# EasyEDA Pro project 40_keyboard.epro, schematic 40键盘

## Sheets
1 键盘矩阵
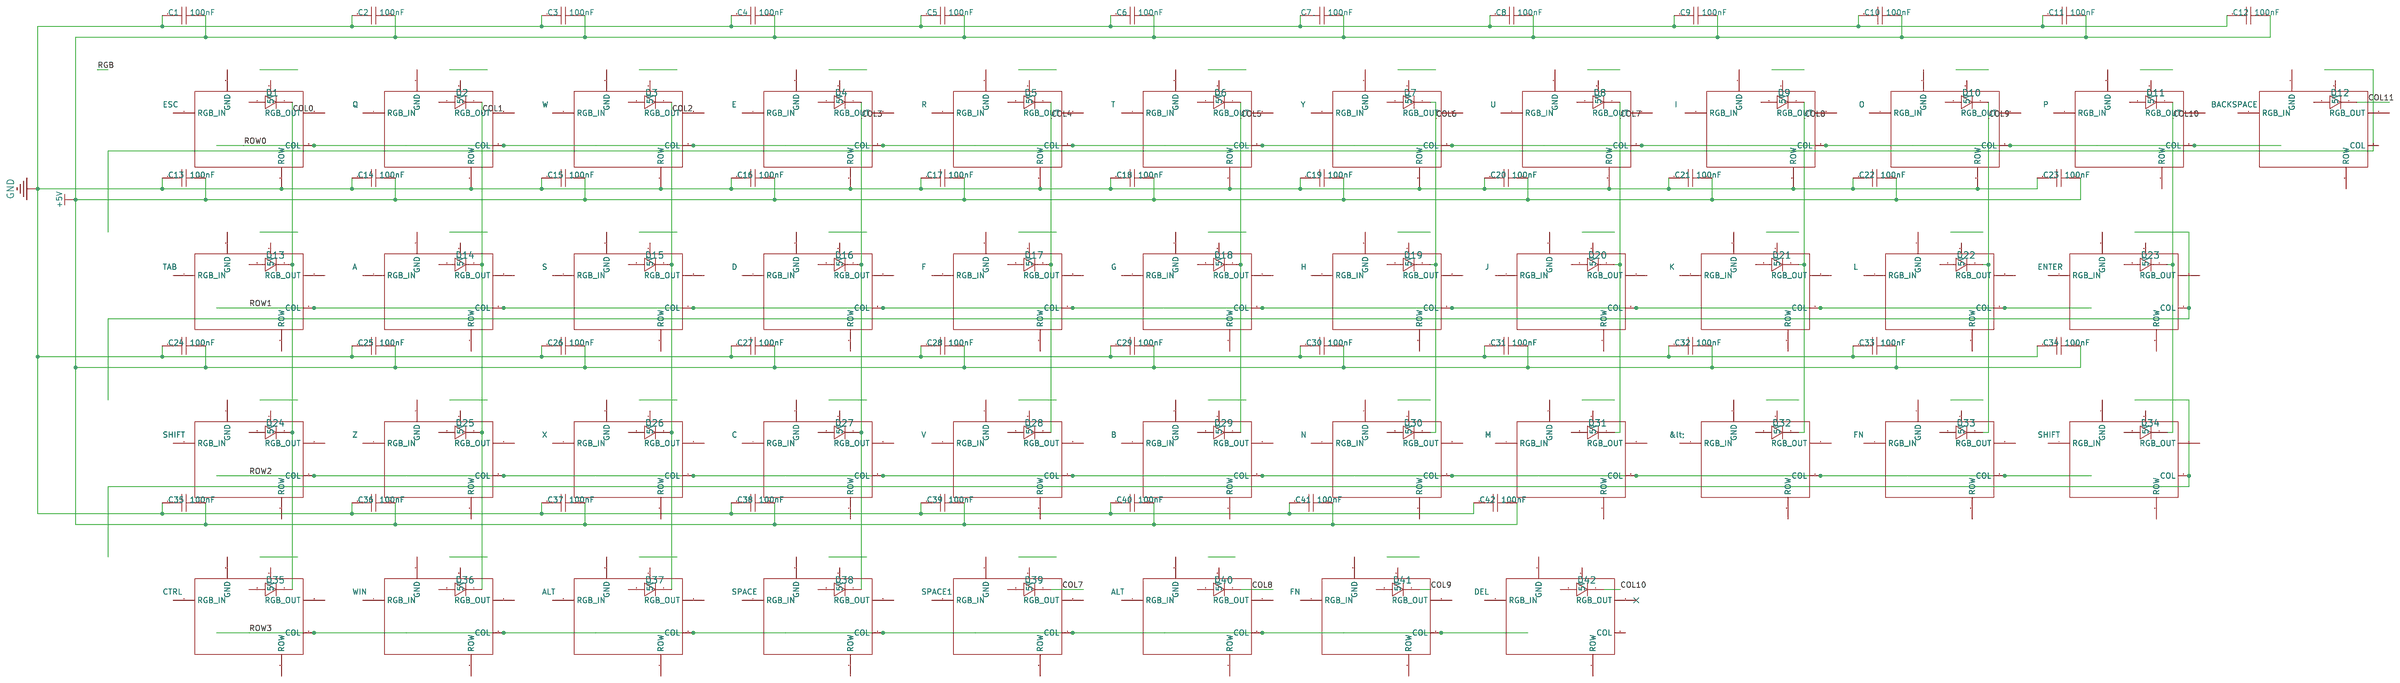
[diagram p0: 键盘矩阵]
2 主控相关: Create Date: 2023-02-02; Page Name: 主控相关; Project Name: 键盘; Schematic Name: 40键盘; Update Date: 2023-02-02; Company: 嘉立创EDA; Page Size: A5; Version: V1.0
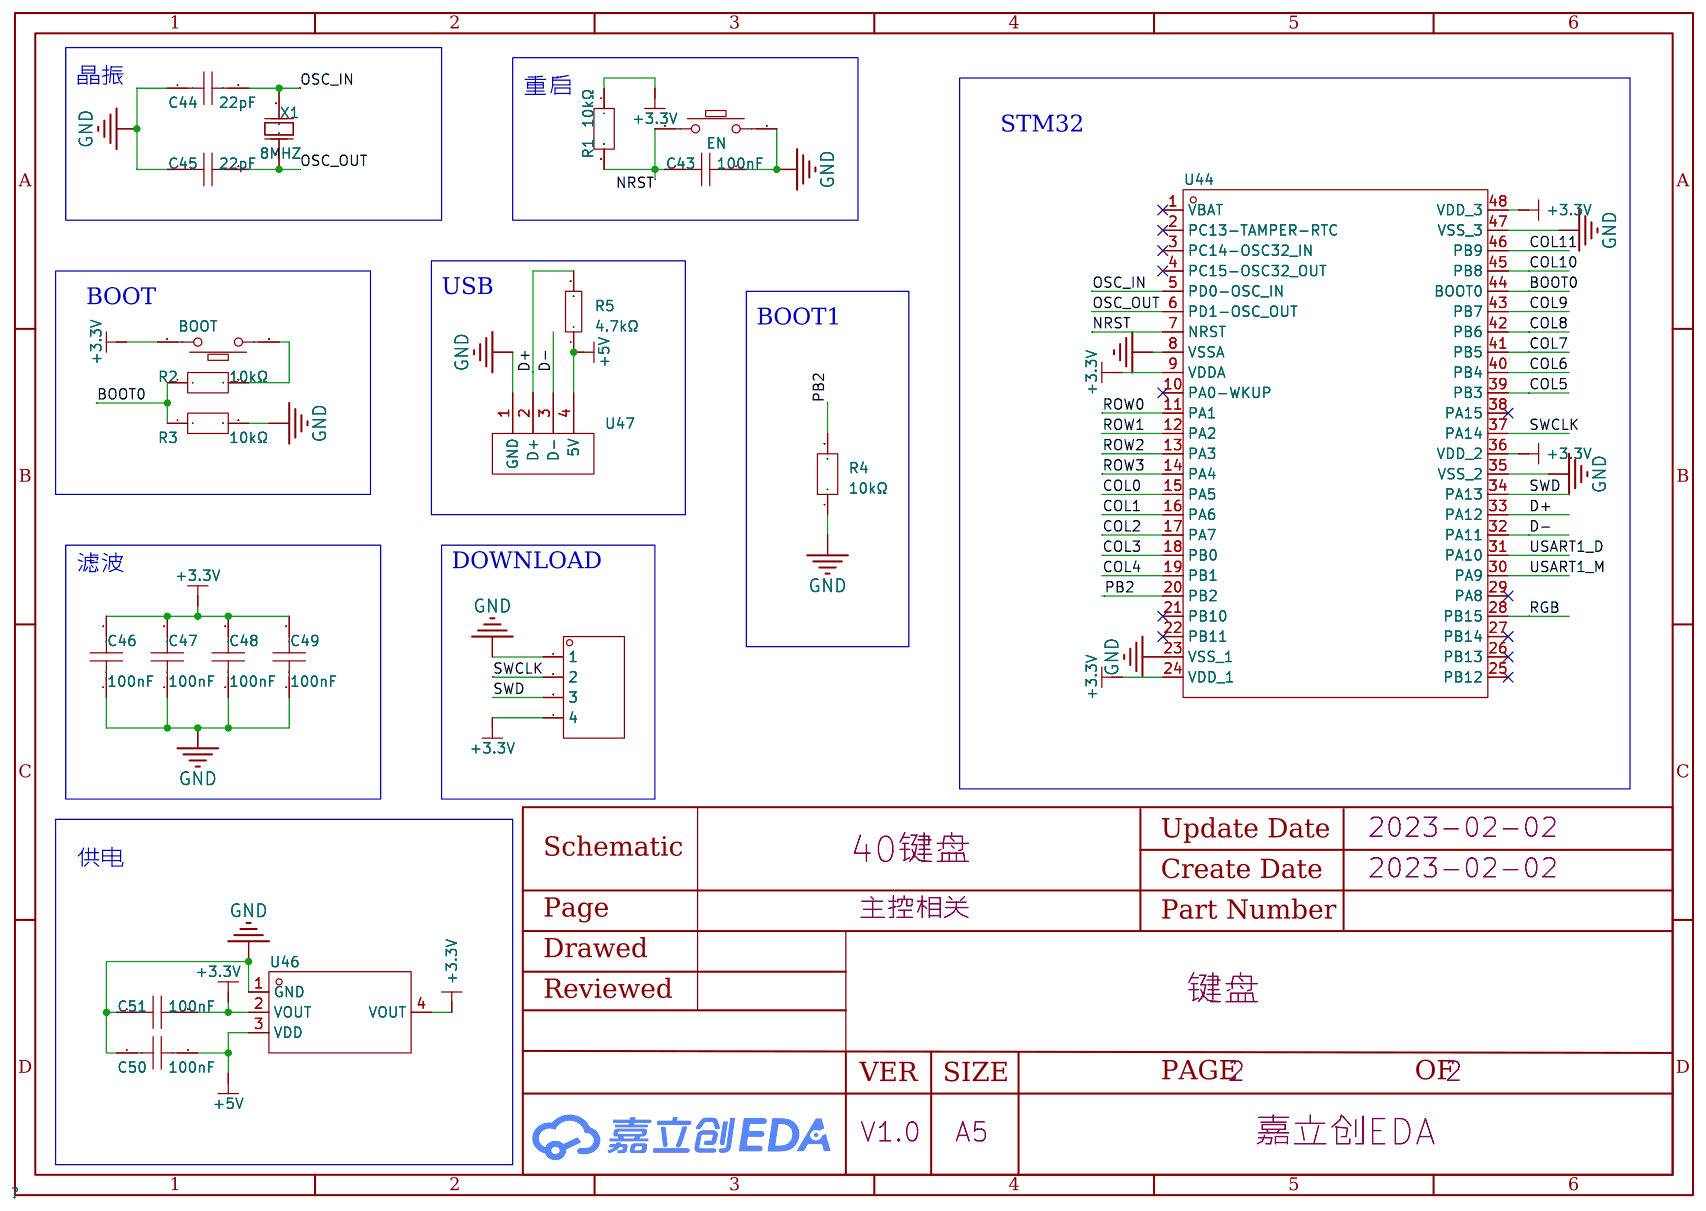
[diagram p1: 主控相关]

## Parts
sheet 主控相关
BOOT  -  [SW-SMD_L6.0-W3.7-LS8.0]
C43  100nF  [C0603]
C44  22pF  [C0603]
C45  22pF  [C0603]
C46  100nF  [C0603]
C47  100nF  [C0603]
C48  100nF  [C0603]
C49  100nF  [C0603]
C50  100nF  [C0603]
C51  100nF  [C0603]
EN  -  [SW-SMD_L6.0-W3.7-LS8.0]
H1  -  [HDR-TH_4P-P2.54-V-M]
R1  10kΩ  [R0603]
R2  10kΩ  [R0603]
R3  10kΩ  [R0603]
R4  10kΩ  [R0603]
R5  4.7kΩ  [R0603]
U44  -  [LQFP-48_L7.0-W7.0-P0.50-LS9.0-BL]
U46  -  [SOT-223_L6.5-W3.5-P2.30-LS7.0-BR]
U47  -  [TYPEC]
X1  8MHZ  [CRYSTAL-SMD_2P-L5.0-W3.2]
sheet 键盘矩阵
C1  100nF  [C0603]
C2  100nF  [C0603]
C3  100nF  [C0603]
C4  100nF  [C0603]
C5  100nF  [C0603]
C6  100nF  [C0603]
C7  100nF  [C0603]
C8  100nF  [C0603]
C9  100nF  [C0603]
C10  100nF  [C0603]
C11  100nF  [C0603]
C12  100nF  [C0603]
C13  100nF  [C0603]
C14  100nF  [C0603]
C15  100nF  [C0603]
C16  100nF  [C0603]
C17  100nF  [C0603]
C18  100nF  [C0603]
C19  100nF  [C0603]
C20  100nF  [C0603]
C21  100nF  [C0603]
C22  100nF  [C0603]
C23  100nF  [C0603]
C24  100nF  [C0603]
C25  100nF  [C0603]
C26  100nF  [C0603]
C27  100nF  [C0603]
C28  100nF  [C0603]
C29  100nF  [C0603]
C30  100nF  [C0603]
C31  100nF  [C0603]
C32  100nF  [C0603]
C33  100nF  [C0603]
C34  100nF  [C0603]
C35  100nF  [C0603]
C36  100nF  [C0603]
C37  100nF  [C0603]
C38  100nF  [C0603]
C39  100nF  [C0603]
C40  100nF  [C0603]
C41  100nF  [C0603]
C42  100nF  [C0603]
D1  IN4148WS  [SOD-323_L1.8-W1.3-LS2.5-RD]
D2  IN4148WS  [SOD-323_L1.8-W1.3-LS2.5-RD]
D3  IN4148WS  [SOD-323_L1.8-W1.3-LS2.5-RD]
D4  IN4148WS  [SOD-323_L1.8-W1.3-LS2.5-RD]
D5  IN4148WS  [SOD-323_L1.8-W1.3-LS2.5-RD]
D6  IN4148WS  [SOD-323_L1.8-W1.3-LS2.5-RD]
D7  IN4148WS  [SOD-323_L1.8-W1.3-LS2.5-RD]
D8  IN4148WS  [SOD-323_L1.8-W1.3-LS2.5-RD]
D9  IN4148WS  [SOD-323_L1.8-W1.3-LS2.5-RD]
D10  IN4148WS  [SOD-323_L1.8-W1.3-LS2.5-RD]
D11  IN4148WS  [SOD-323_L1.8-W1.3-LS2.5-RD]
D12  IN4148WS  [SOD-323_L1.8-W1.3-LS2.5-RD]
D13  IN4148WS  [SOD-323_L1.8-W1.3-LS2.5-RD]
D14  IN4148WS  [SOD-323_L1.8-W1.3-LS2.5-RD]
D15  IN4148WS  [SOD-323_L1.8-W1.3-LS2.5-RD]
D16  IN4148WS  [SOD-323_L1.8-W1.3-LS2.5-RD]
D17  IN4148WS  [SOD-323_L1.8-W1.3-LS2.5-RD]
D18  IN4148WS  [SOD-323_L1.8-W1.3-LS2.5-RD]
D19  IN4148WS  [SOD-323_L1.8-W1.3-LS2.5-RD]
D20  IN4148WS  [SOD-323_L1.8-W1.3-LS2.5-RD]
D21  IN4148WS  [SOD-323_L1.8-W1.3-LS2.5-RD]
D22  IN4148WS  [SOD-323_L1.8-W1.3-LS2.5-RD]
D23  IN4148WS  [SOD-323_L1.8-W1.3-LS2.5-RD]
D24  IN4148WS  [SOD-323_L1.8-W1.3-LS2.5-RD]
D25  IN4148WS  [SOD-323_L1.8-W1.3-LS2.5-RD]
D26  IN4148WS  [SOD-323_L1.8-W1.3-LS2.5-RD]
D27  IN4148WS  [SOD-323_L1.8-W1.3-LS2.5-RD]
D28  IN4148WS  [SOD-323_L1.8-W1.3-LS2.5-RD]
D29  IN4148WS  [SOD-323_L1.8-W1.3-LS2.5-RD]
D30  IN4148WS  [SOD-323_L1.8-W1.3-LS2.5-RD]
D31  IN4148WS  [SOD-323_L1.8-W1.3-LS2.5-RD]
D32  IN4148WS  [SOD-323_L1.8-W1.3-LS2.5-RD]
D33  IN4148WS  [SOD-323_L1.8-W1.3-LS2.5-RD]
D34  IN4148WS  [SOD-323_L1.8-W1.3-LS2.5-RD]
D35  IN4148WS  [SOD-323_L1.8-W1.3-LS2.5-RD]
D36  IN4148WS  [SOD-323_L1.8-W1.3-LS2.5-RD]
D37  IN4148WS  [SOD-323_L1.8-W1.3-LS2.5-RD]
D38  IN4148WS  [SOD-323_L1.8-W1.3-LS2.5-RD]
D39  IN4148WS  [SOD-323_L1.8-W1.3-LS2.5-RD]
D40  IN4148WS  [SOD-323_L1.8-W1.3-LS2.5-RD]
D41  IN4148WS  [SOD-323_L1.8-W1.3-LS2.5-RD]
D42  IN4148WS  [SOD-323_L1.8-W1.3-LS2.5-RD]
U1  ESC  [反贴rgb仅焊接轴]
U2  Q  [反贴rgb仅焊接轴]
U3  W  [反贴rgb仅焊接轴]
U4  E  [反贴rgb仅焊接轴]
U5  R  [反贴rgb仅焊接轴]
U6  T  [反贴rgb仅焊接轴]
U7  Y  [反贴rgb仅焊接轴]
U8  U  [反贴rgb仅焊接轴]
U9  I  [反贴rgb仅焊接轴]
U10  O  [反贴rgb仅焊接轴]
U11  P  [反贴rgb仅焊接轴]
U12  BACKSPACE  [反贴rgb仅焊接轴]
U13  TAB  [反贴rgb仅焊接轴]
U14  A  [反贴rgb仅焊接轴]
U15  S  [反贴rgb仅焊接轴]
U16  D  [反贴rgb仅焊接轴]
U17  F  [反贴rgb仅焊接轴]
U18  G  [反贴rgb仅焊接轴]
U19  H  [反贴rgb仅焊接轴]
U20  J  [反贴rgb仅焊接轴]
U21  K  [反贴rgb仅焊接轴]
U22  L  [反贴rgb仅焊接轴]
U23  ENTER  [反贴rgb仅焊接轴]
U24  SHIFT  [反贴rgb仅焊接轴]
U25  Z  [反贴rgb仅焊接轴]
U26  X  [反贴rgb仅焊接轴]
U27  C  [反贴rgb仅焊接轴]
U28  V  [反贴rgb仅焊接轴]
U29  B  [反贴rgb仅焊接轴]
U30  N  [反贴rgb仅焊接轴]
U31  M  [反贴rgb仅焊接轴]
U32  &lt;  [反贴rgb仅焊接轴]
U33  FN  [反贴rgb仅焊接轴]
U34  SHIFT  [反贴rgb仅焊接轴]
U35  CTRL  [反贴rgb仅焊接轴]
U36  WIN  [反贴rgb仅焊接轴]
U37  ALT  [反贴rgb仅焊接轴]
U38  SPACE  [反贴rgb仅焊接轴]
U39  SPACE1  [反贴rgb仅焊接轴]
U40  ALT  [反贴rgb仅焊接轴]
U41  FN  [反贴rgb仅焊接轴]
U42  DEL  [反贴rgb仅焊接轴]

## Library data of the parts
BOOT EN = TS-1107-025E-W: 轻触开关/TS-1107-025E; LCSC Part Name: 轻触开关/TS-1107-025E; Supplier Part: C2939214; Manufacturer: HOOYA(香港皓宇); Supplier Footprint: SMD; Datasheet: https://atta.szlcsc.com/upload/public/pdf/source/20220629/BFBE6602B3F172776706CD86E3EAF173.pdf; Supplier: LCSC
C1-C43 C46-C51 = CC0603KRX7R9BB104: 容值:100nF;精度:±10%;额定电压:50V;温度系数:X7R;; LCSC Part Name: 100nF ±10% 50V; Supplier Part: C14663; Manufacturer: YAGEO(国巨); Supplier Footprint: 0603; JLCPCB Part Class: Basic Part; Datasheet: https://atta.szlcsc.com/upload/public/pdf/source/20170116/1484561234239.pdf; Supplier: LCSC; Tolerance: ±10%; Voltage Rated: 50V; Temperature Coefficient: X7R
C44 C45 = C0603C220K4GAC7867: 容值:22pF;精度:±10%;额定电压:16V;温度系数:C0G;; LCSC Part Name: 22pF ±10% 16V; Supplier Part: C599693; Manufacturer: KEMET(基美); Supplier Footprint: 0603; JLCPCB Part Class: Extended Part; Datasheet: https://atta.szlcsc.com/upload/public/pdf/source/20200618/C599693_6DA331CD029F9269394E639C222571D4.pdf; Supplier: LCSC; Tolerance: ±10%; Voltage Rated: 16V; Temperature Coefficient: C0G
H1 = B-2100S04P-A110: 间距:2.54mm;总PIN位数:4;排数:1;插针结构:1x4P;行距:-;安装类型:直插;圆针/方针:-;额定电流:-;额定电压:-;配合针长度:6mm;塑高:2.54mm;端接针长度:3mm;触头材质:黄铜;触头镀层:-;工作温度范围:-40~+105;颜色:黑色;; Supplier: LCSC; Supplier Part: C124378; Supplier Footprint: 插件,P=2.54mm; JLCPCB Part Class: Extended Part; LCSC Part Name: 2.54mm 1x4P; Datasheet: https://atta.szlcsc.com/upload/public/pdf/source/20170821/C124378_1503303307508901532.pdf; Color: 黑色; Manufacturer: Ckmtw(灿科盟); Contact Material: 黄铜; Insulation Height: 2.54mm; Length of End Connection Pin: 3mm; Length of Mating Pin: 6mm; Mounting Type: 直插; Number of Pins: 4; Number of Rows: 1; Operating Temperature Range: -40~+105; Pin Structure: 1x4P; Pitch: 2.54mm
R1-R4 = RT0603BRD072K43L: 电阻类型:薄膜电阻;阻值:2.43kΩ;精度:±0.1%;功率:100mW;温度系数:±25ppm/;工作温度范围:-55~+155;; LCSC Part Name: 2.43kΩ ±0.1% 100mW; Supplier Part: C861298; Manufacturer: YAGEO(国巨); Supplier Footprint: 0603; JLCPCB Part Class: 扩展库; Datasheet: https://atta.szlcsc.comnull; Supplier: LCSC; Type: 薄膜电阻; Tolerance: ±0.1%; Power(Watts): 100mW; Temperature Coefficient: ±25ppm/; Operating Temperature Range: -55~+155
R5 = RK73B1JTTD472J: 阻值:4.7kΩ;精度:±5%;功率:100mW;温度系数:±200ppm/;最大工作电压:50V;工作温度范围:-55~+155;; LCSC Part Name: 4.7kΩ ±5%; Supplier Part: C131711; Manufacturer: KOA; Supplier Footprint: 0603; JLCPCB Part Class: Extended Part; Datasheet: https://atta.szlcsc.com/upload/public/pdf/source/20170918/C131711_1505727053069976494.pdf; Supplier: LCSC; Tolerance: ±5%; Power(Watts): 100mW; Temperature Coefficient: ±200ppm/; Overload Voltage (Max): 50V; Operating Temperature Range: -55~+155
U44 = STM32F103C8T6: 工作电压:2V ~ 3.6V;CPU位数:32-Bit;CPU内核:ARM® Cortex®-M3;主频（MAX):72MHz;ROM类型:FLASH;; Supplier Part: C8734; Manufacturer: ST(意法半导体); Supplier Footprint: LQFP-48_7x7x05P; JLCPCB Part Class: Basic Part; Datasheet: https://atta.szlcsc.com/upload/public/pdf/source/20140724/1457707174202.pdf; Supplier: LCSC
U46 = BL9110-330BPFB: 输出类型:固定;输出极性:正;输出通道数:1;最大输入电压:6V;输出电压:3.3V;压差:390mV@(1A);输出电流:1A;电源纹波抑制比(PRSS):70dB@(1kHz);; LCSC Part Name: Vin=6V Vout=3.3V 1A 70dB@(1kHz); Supplier Part: C169246; Manufacturer: BL(上海贝岭); Supplier Footprint: SOT-223; JLCPCB Part Class: Extended Part; Datasheet: https://atta.szlcsc.com/upload/public/pdf/source/20180104/C169246_15150688220401230505.pdf; Supplier: LCSC; Output Type: 固定; Output Polarity: 正; Number of Outputs: 1; Maximum Input Voltage: 6V; Output Voltage: 3.3V; Dropout Voltage: 390mV@(1A); Output Current: 1A; Power Supply Rejection Ratio (PRSS): 70dB@(1kHz)
U47 = typec
X1 = TXM27.12M0002503HFBEO00T: 晶振类型:SMD 谐振器;频率:27.12MHz;频率公差:±30ppm;频率稳定度:±30ppm;负载电容:15pF;等效串联电阻(ESR):30Ω;工作温度:-;; LCSC Part Name: 27.12MHz ±30ppm 15pF; Supplier Part: C362484; Manufacturer: TAE(雅晶鑫); Supplier Footprint: SMD5032-2P; JLCPCB Part Class: 扩展库; Datasheet: https://atta.szlcsc.com/upload/public/pdf/source/20190124/C362484_5A682EAC5335604A9F328A2CCE389183.pdf; Supplier: LCSC; Crystal Type: SMD 谐振器; Frequency Tolerance: ±30ppm; Frequency Stability: ±30ppm; Load Capacitance: 15pF; Equivalent Series Resistance (ESR): 30Ω
D1-D42 = IN4148WS: Supplier: LCSC; Supplier Part: C417545; Manufacturer: Leshan Radio
U1-U42 = 反贴rgb 焊接轴: 反贴封装6020

## Nets
+3.3V: BOOT.2 C46.2 C47.2 C48.2 C49.2 C51.2 H1.4 R1.1 U44.9(VDDA) U44.24(VDD_1) U44.36(VDD_2) U44.48(VDD_3) U46.2(VOUT) U46.4(VOUT)
+5V: C1.1 C2.1 C3.1 C4.1 C5.1 C6.1 C7.1 C8.1 C9.1 C10.1 C11.1 C12.1 C13.1 C14.1 C15.1 C16.1 C17.1 C18.1 C19.1 C20.1 C21.1 C22.1 C23.1 C24.1 C25.1 C26.1 C27.1 C28.1 C29.1 C30.1 C31.1 C32.1 C33.1 C34.1 C35.1 C36.1 C37.1 C38.1 C39.1 C40.1 C41.1 C42.1 C50.2 R5.1 U46.3(VDD) U47.4(5V)
GND: C1.2 C2.2 C3.2 C4.2 C5.2 C6.2 C7.2 C8.2 C9.2 C10.2 C11.2 C12.2 C13.2 C14.2 C15.2 C16.2 C17.2 C18.2 C19.2 C20.2 C21.2 C22.2 C23.2 C24.2 C25.2 C26.2 C27.2 C28.2 C29.2 C30.2 C31.2 C32.2 C33.2 C34.2 C35.2 C36.2 C37.2 C38.2 C39.2 C40.2 C41.2 C42.2 C43.1 C44.1 C45.1 C46.1 C47.1 C48.1 C49.1 C50.1 C51.1 EN.2 H1.1 R3.2 R4.1 U1.5(ROW) U2.5(ROW) U3.5(ROW) U4.5(ROW) U5.5(ROW) U6.5(ROW) U7.5(ROW) U8.5(ROW) U9.5(ROW) U10.5(ROW) U44.8(VSSA) U44.23(VSS_1) U44.35(VSS_2) U44.47(VSS_3) U46.1(GND) U47.1(GND)
BOOT0: R2.1 R3.1 U44.44(BOOT0)
COL0: D1.1(C) D13.1(C) D24.1(C) D35.1(C) U44.15(PA5)
COL1: D2.1(C) D14.1(C) D25.1(C) D36.1(C) U44.16(PA6)
COL2: D3.1(C) D15.1(C) D26.1(C) D37.1(C) U44.17(PA7)
COL3: D4.1(C) D16.1(C) D27.1(C) D38.1(C) U44.18(PB0)
COL4: D5.1(C) D17.1(C) D28.1(C) U44.19(PB1)
COL5: D6.1(C) D18.1(C) D29.1(C) U44.39(PB3)
COL6: D7.1(C) D19.1(C) D30.1(C) U44.40(PB4)
COL7: D8.1(C) D20.1(C) D31.1(C) D39.1(C) U44.41(PB5)
COL8: D9.1(C) D21.1(C) D32.1(C) D40.1(C) U44.42(PB6)
COL9: D10.1(C) D22.1(C) D33.1(C) D41.1(C) U44.43(PB7)
COL10: D11.1(C) D23.1(C) D34.1(C) D42.1(C) U44.45(PB8)
COL11: D12.1(C) U44.46(PB9)
D+: R5.2 U44.33(PA12) U47.2(D+)
D-: U44.32(PA11) U47.3(D-)
NRST: C43.2 EN.1 R1.2 U44.7(NRST)
OSC_IN: C44.2 U44.5(PD0-OSC_IN) X1.2(OSC2)
OSC_OUT: C45.2 U44.6(PD1-OSC_OUT) X1.1(OSC1)
PB2: R4.2 U44.20(PB2)
RGB: U44.28(PB15)
ROW0: U1.6(COL) U2.6(COL) U3.6(COL) U4.6(COL) U5.6(COL) U6.6(COL) U7.6(COL) U8.6(COL) U9.6(COL) U10.6(COL) U11.6(COL) U44.11(PA1)
ROW1: U13.6(COL) U14.6(COL) U15.6(COL) U16.6(COL) U17.6(COL) U18.6(COL) U19.6(COL) U20.6(COL) U21.6(COL) U22.6(COL) U44.12(PA2)
ROW2: U24.6(COL) U25.6(COL) U26.6(COL) U27.6(COL) U28.6(COL) U29.6(COL) U30.6(COL) U31.6(COL) U32.6(COL) U33.6(COL) U44.13(PA3)
ROW3: U35.6(COL) U36.6(COL) U37.6(COL) U38.6(COL) U39.6(COL) U40.6(COL) U41.6(COL) U44.14(PA4)
SWCLK: H1.2 U44.37(PA14)
SWD: H1.3 U44.34(PA13)
USART1_D: U44.31(PA10)
USART1_M: U44.30(PA9)
$2N10725: BOOT.1 R2.2

Not connected (* = marked no-connect by the designer): D1 2(A); D2 2(A); D3 2(A); D4 2(A); D5 2(A); D6 2(A); D7 2(A); D8 2(A); D9 2(A); D10 2(A); D11 2(A); D12 2(A); D13 2(A); D14 2(A); D15 2(A); D16 2(A); D17 2(A); D18 2(A); D19 2(A); D20 2(A); D21 2(A); D22 2(A); D23 2(A); D24 2(A); D25 2(A); D26 2(A); D27 2(A); D28 2(A); D29 2(A); D30 2(A); D31 2(A); D32 2(A); D33 2(A); D34 2(A); D35 2(A); D36 2(A); D37 2(A); D38 2(A); D39 2(A); D40 2(A); D41 2(A); D42 2(A); U1 1(GND) 2(5V) 3(RGB_OUT) 4(RGB_IN); U2 1(GND) 2(5V) 3(RGB_OUT) 4(RGB_IN); U3 1(GND) 2(5V) 3(RGB_OUT) 4(RGB_IN); U4 1(GND) 2(5V) 3(RGB_OUT) 4(RGB_IN); U5 1(GND) 2(5V) 3(RGB_OUT) 4(RGB_IN); U6 1(GND) 2(5V) 3(RGB_OUT) 4(RGB_IN); U7 1(GND) 2(5V) 3(RGB_OUT) 4(RGB_IN); U8 1(GND) 2(5V) 3(RGB_OUT) 4(RGB_IN); U9 1(GND) 2(5V) 3(RGB_OUT) 4(RGB_IN); U10 1(GND) 2(5V) 3(RGB_OUT) 4(RGB_IN); U11 1(GND) 2(5V) 3(RGB_OUT) 4(RGB_IN) 5(ROW); U12 1(GND) 2(5V) 3(RGB_OUT) 4(RGB_IN) 5(ROW) 6(COL); U13 1(GND) 2(5V) 3(RGB_OUT) 4(RGB_IN) 5(ROW); U14 1(GND) 2(5V) 3(RGB_OUT) 4(RGB_IN) 5(ROW); U15 1(GND) 2(5V) 3(RGB_OUT) 4(RGB_IN) 5(ROW); U16 1(GND) 2(5V) 3(RGB_OUT) 4(RGB_IN) 5(ROW); U17 1(GND) 2(5V) 3(RGB_OUT) 4(RGB_IN) 5(ROW); U18 1(GND) 2(5V) 3(RGB_OUT) 4(RGB_IN) 5(ROW); U19 1(GND) 2(5V) 3(RGB_OUT) 4(RGB_IN) 5(ROW); U20 1(GND) 2(5V) 3(RGB_OUT) 4(RGB_IN) 5(ROW); U21 1(GND) 2(5V) 3(RGB_OUT) 4(RGB_IN) 5(ROW); U22 1(GND) 2(5V) 3(RGB_OUT) 4(RGB_IN) 5(ROW); U23 1(GND) 2(5V) 3(RGB_OUT) 4(RGB_IN) 5(ROW) 6(COL); U24 1(GND) 2(5V) 3(RGB_OUT) 4(RGB_IN) 5(ROW); U25 1(GND) 2(5V) 3(RGB_OUT) 4(RGB_IN) 5(ROW); U26 1(GND) 2(5V) 3(RGB_OUT) 4(RGB_IN) 5(ROW); U27 1(GND) 2(5V) 3(RGB_OUT) 4(RGB_IN) 5(ROW); U28 1(GND) 2(5V) 3(RGB_OUT) 4(RGB_IN) 5(ROW); U29 1(GND) 2(5V) 3(RGB_OUT) 4(RGB_IN) 5(ROW); U30 1(GND) 2(5V) 3(RGB_OUT) 4(RGB_IN) 5(ROW); U31 1(GND) 2(5V) 3(RGB_OUT) 4(RGB_IN) 5(ROW); U32 1(GND) 2(5V) 3(RGB_OUT) 4(RGB_IN) 5(ROW); U33 1(GND) 2(5V) 3(RGB_OUT) 4(RGB_IN) 5(ROW); U34 1(GND) 2(5V) 3(RGB_OUT) 4(RGB_IN) 5(ROW) 6(COL); U35 1(GND) 2(5V) 3(RGB_OUT) 4(RGB_IN) 5(ROW); U36 1(GND) 2(5V) 3(RGB_OUT) 4(RGB_IN) 5(ROW); U37 1(GND) 2(5V) 3(RGB_OUT) 4(RGB_IN) 5(ROW); U38 1(GND) 2(5V) 3(RGB_OUT) 4(RGB_IN) 5(ROW); U39 1(GND) 2(5V) 3(RGB_OUT) 4(RGB_IN) 5(ROW); U40 1(GND) 2(5V) 3(RGB_OUT) 4(RGB_IN) 5(ROW); U41 1(GND) 2(5V) 3(RGB_OUT) 4(RGB_IN) 5(ROW); U42 1(GND) 2(5V) 3(RGB_OUT)* 4(RGB_IN) 5(ROW) 6(COL); U44 1(VBAT)* 2(PC13-TAMPER-RTC)* 3(PC14-OSC32_IN)* 4(PC15-OSC32_OUT)* 10(PA0-WKUP)* 21(PB10)* 22(PB11)* 25(PB12)* 26(PB13)* 27(PB14)* 29(PA8)* 38(PA15)*

## Notes on the sheets
sheet 2
- 晶振
- 重启
- STM32
- USB
- BOOT
- BOOT1
- 滤波
- DOWNLOAD
- 供电
